# Altium project STM32L496 Breakout.PrjPcb
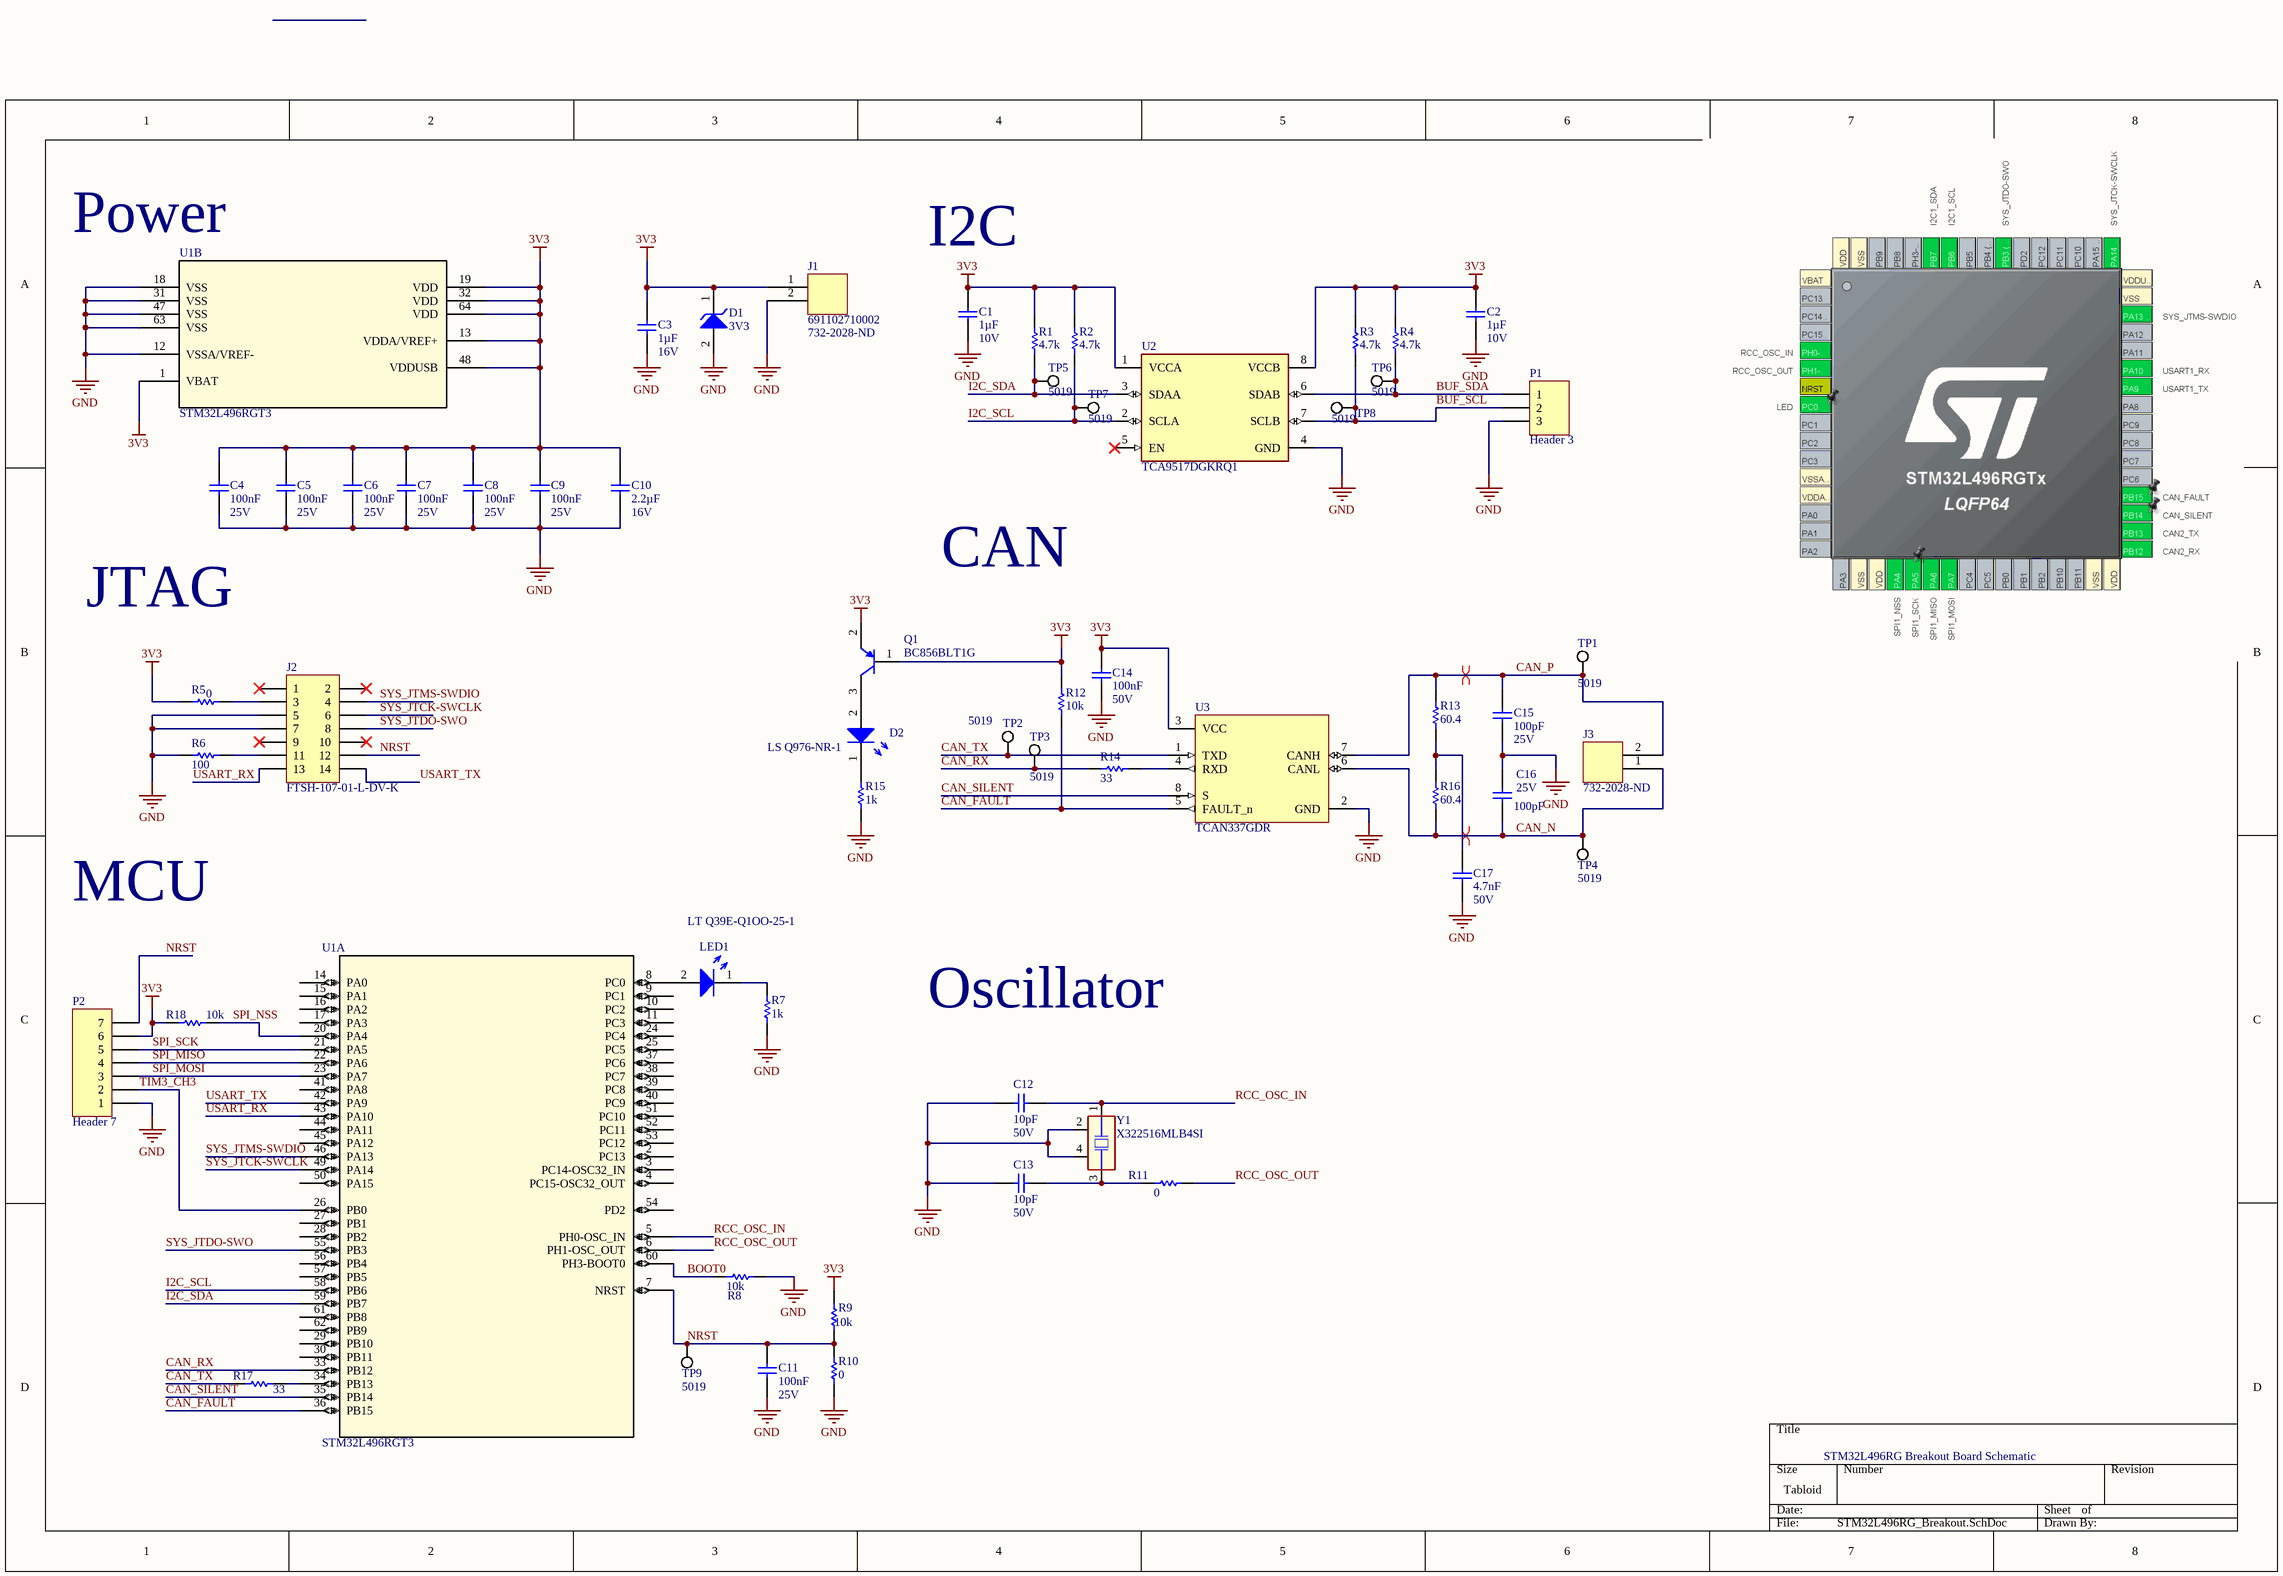
[diagram p0: STM32L496RG_Breakout.SchDoc]
1 sheet, 57 parts. Net scope: global (net labels, ports and power ports of the same name join across sheets).
Board file: STM32L496RG_Breakout.PcbDoc

## Sheet STM32L496RG_Breakout.SchDoc
size Tabloid; SheetNumber: 1; SheetTotal: 1

### Parts
C1  value 1µF  Voltage Rating: 10V  [CAP0805R]  (hidden comment: LMK212B7105KGHTR)
C2  value 1µF  Voltage Rating: 10V  [CAP0805R]  (hidden comment: LMK212B7105KGHTR)
C3  value 1µF  Voltage Rating: 16V  [CAP0805R]  (hidden comment: GCM21BR71C105KA58L)
C4  value 100nF  Voltage Rating: 25V  [CAP0603R]  (hidden comment: CGA3E2X7R1E104K080AA)
C5  value 100nF  Voltage Rating: 25V  [CAP0603R]  (hidden comment: CGA3E2X7R1E104K080AA)
C6  value 100nF  Voltage Rating: 25V  [CAP0603R]  (hidden comment: CGA3E2X7R1E104K080AA)
C7  value 100nF  Voltage Rating: 25V  [CAP0603R]  (hidden comment: CGA3E2X7R1E104K080AA)
C8  value 100nF  Voltage Rating: 25V  [CAP0603R]  (hidden comment: CGA3E2X7R1E104K080AA)
C9  value 100nF  Voltage Rating: 25V  [CAP0603R]  (hidden comment: CGA3E2X7R1E104K080AA)
C10  value 2.2µF  Voltage Rating: 16V  [CAP0805R]  (hidden comment: GCM21BR71C225KA64L)
C11  value 100nF  Voltage Rating: 25V  [CAP0603R]  (hidden comment: CGA3E2X7R1E104K080AA)
C12  value 10pF  Voltage Rating: 50V  [CAP0402R]  (hidden comment: GCQ1555C1H100JB01D)
C13  value 10pF  Voltage Rating: 50V  [CAP0402R]  (hidden comment: GCQ1555C1H100JB01D)
C14  value 100nF  Voltage Rating: 50V  [CAP0603R]  (hidden comment: CGA3E2X7R1H104K080AE)
C15  value 100pF  Voltage Rating: 25V  [CAP0603R]  (hidden comment: C0603C101K3GACTU)
C16  value 100pF  Voltage Rating: 25V  [CAP0603R]  (hidden comment: C0603C101K3GACTU)
C17  value 4.7nF  Voltage Rating: 50V  [CAP0603R]  (hidden comment: CGA3E2X7R1H472K080AA)
D1  3V3  [ONSC-SOD-323-2-477-02_V]
D2  LS Q976-NR-1  [LED0603]
J1  691102710002  Supplier Part Number 1: 732-2028-ND  [CON2_SCREW_5.00MM_691102710002]
J2  FTSH-107-01-L-DV-K  [FP-FTSH-107-01-L-DV-K-MFG]
J3  Supplier Part Number 1: 732-2028-ND  [CON2_SCREW_5.00MM_691102710002]  (hidden comment: 691102710002)
LED1  LT Q39E-Q1OO-25-1  [LED0603]
P1  Header 3  [HDR1X3]
P2  Header 7  [HDR1X7]
Q1  BC856BLT1G  [ONSC-SOT-23-3-318-08_V]
R1  value 4.7k  [RES0603R]  (hidden comment: CRCW06034K70FKEA)
R2  value 4.7k  [RES0603R]  (hidden comment: CRCW06034K70FKEA)
R3  value 4.7k  [RES0603R]  (hidden comment: CRCW06034K70FKEA)
R4  value 4.7k  [RES0603R]  (hidden comment: CRCW06034K70FKEA)
R5  value 0  [RES0805R]  (hidden comment: ERJ-6GEY0R00V)
R6  value 100  [RES0603R]  (hidden comment: ERJ-3GEYJ101V)
R7  value 1k  [RES0805R]  (hidden comment: CRCW08051K00FKTC)
R8  value 10k  [RES0603R]  (hidden comment: ERJ-3GEYJ103V)
R9  value 10k  [RES0603R]  (hidden comment: ERJ-3GEYJ103V)
R10  value 0  [RES0805R]  (hidden comment: ERJ-6GEY0R00V)
R11  value 0  [RES0805R]  (hidden comment: ERJ-6GEY0R00V)
R12  value 10k  [RES0603R]  (hidden comment: CRCW060310K0FKEA)
R13  value 60.4  [RES0603R]  (hidden comment: CRCW060360R4FKEA)
R14  value 33  [RES0603R]  (hidden comment: CRCW060333R0FKEA)
R15  value 1k  [RES0603R]  (hidden comment: CRCW06031K00FKEA)
R16  value 60.4  [RES0603R]  (hidden comment: CRCW060360R4FKEA)
R17  value 33  [RES0603R]  (hidden comment: CRCW060333R0FKEA)
R18  value 10k  [RES0603R]  (hidden comment: RCG060310K0FKEA)
TP1  5019  [KSTN-5019_V]
TP2  5019  [KSTN-5019_V]
TP3  5019  [KSTN-5019_V]
TP4  5019  [KSTN-5019_V]
TP5  5019  [KSTN-5019_V]
TP6  5019  [KSTN-5019_V]
TP7  5019  [KSTN-5019_V]
TP8  5019  [KSTN-5019_V]
TP9  5019  [KSTN-5019_V]
U1  STM32L496RGT3  [LQFP64-10x10mm]  (parts A,B of 2)
U2  TCA9517DGKRQ1  [FP-DGK0008A-MFG]
U3  TCAN337GDR  [TI-D0008A]
Y1  X322516MLB4SI  [X322516MLB4SI-Footprint-1]

### Nets
3V3: C1.2 C2.2 C3.2 C4.2 C5.2 C6.2 C7.2 C8.2 C9.2 C10.2 C14.2 D1.1(K) J1.1 P2.6 Q1.1(B) Q1.2(E) R1.2 R2.2 R3.2 R4.2 R5.1 R9.2 R12.2 R18.1 U1.1(VBAT) U1.13(VDDA/VREF+) U1.19(VDD) U1.32(VDD) U1.48(VDDUSB) U1.64(VDD) U2.1(VCCA) U2.8(VCCB) U3.3(VCC)
GND: C1.1 C2.1 C3.1 C4.1 C5.1 C6.1 C7.1 C8.1 C9.1 C10.1 C11.1 C12.2 C13.2 C14.1 C15.1 C16.2 C17.1 D1.2(A) J1.2 J2.5 J2.7 P1.3 P2.1 R6.1 R7.1 R8.2 R10.1 R15.1 U1.12(VSSA/VREF-) U1.18(VSS) U1.31(VSS) U1.47(VSS) U1.63(VSS) U2.4(GND) U3.2(GND) Y1.2(GND) Y1.4(GND)
BOOT0: R8.1 U1.60(PH3-BOOT0)
BUF_SCL: P1.2 R3.1 TP8.1 U2.7(SCLB)
BUF_SDA: P1.1 R4.1 TP6.1 U2.6(SDAB)
CAN_FAULT: R12.1 U1.36(PB15) U3.5(FAULT_n)
CAN_N: C16.1 J3.1 R16.1 TP4.1 U3.6(CANL)
CAN_P: C15.2 J3.2 R13.2 TP1.1 U3.7(CANH)
CAN_RX: R14.1 TP3.1 U1.33(PB12)
CAN_SILENT: U1.35(PB14) U3.8(S)
CAN_TX: R17.1 TP2.1 U3.1(TXD)
I2C_SCL: R2.1 TP7.1 U1.58(PB6) U2.2(SCLA)
I2C_SDA: R1.1 TP5.1 U1.59(PB7) U2.3(SDAA)
NRST: C11.2 J2.12 P2.7 R9.1 R10.2 TP9.1 U1.7(NRST)
RCC_OSC_IN: C12.1 U1.5(PH0-OSC_IN) Y1.1(OSC1)
RCC_OSC_OUT: R11.2 U1.6(PH1-OSC_OUT)
SPI_MISO: P2.4 U1.22(PA6)
SPI_MOSI: P2.3 U1.23(PA7)
SPI_NSS: R18.2 U1.20(PA4)
SPI_SCK: P2.5 U1.21(PA5)
SYS_JTCK-SWCLK: J2.6 U1.49(PA14)
SYS_JTDO-SWO: J2.8 U1.55(PB3)
SYS_JTMS-SWDIO: J2.4 U1.46(PA13)
TIM3_CH3: P2.2 U1.26(PB0)
USART_RX: J2.13 U1.43(PA10)
USART_TX: J2.14 U1.42(PA9)
NetC13_1: C13.1 R11.1 Y1.3(OSC2)
NetC17_2: C17.2 R13.1 R16.2
NetD2_1: D2.1(Cathode) R15.2
NetD2_2: D2.2(Anode) Q1.3(C)
NetJ2_3: J2.3 R5.2
NetJ2_11: J2.11 R6.2
NetLED1_1: LED1.1(Cathode) R7.2
NetLED1_2: LED1.2(Anode) U1.8(PC0)
NetR14_2: R14.2 U3.4(RXD)
NetR17_2: R17.2 U1.34(PB13)

Not connected (* = marked no-connect by the designer): J2 1* 2* 9* 10*; U1 2(PC13) 3(PC14-OSC32_IN) 4(PC15-OSC32_OUT) 9(PC1) 10(PC2) 11(PC3) 14(PA0) 15(PA1) 16(PA2) 17(PA3) 24(PC4) 25(PC5) 27(PB1) 28(PB2) 29(PB10) 30(PB11) 37(PC6) 38(PC7) 39(PC8) 40(PC9) 41(PA8) 44(PA11) 45(PA12) 50(PA15) 51(PC10) 52(PC11) 53(PC12) 54(PD2) 56(PB4) 57(PB5) 61(PB8) 62(PB9); U2 5(EN)*

### Layout directives
differential pair: CAN_N, CAN_P

### Notes on the sheet
- (near U1) Power
- I2C
- CAN
- JTAG
- MCU
- Oscillator
- STM32L496RG Breakout Board Schematic

### Library data of the parts
C1 C2 = CMP-024-001219-8: CAP CER 1UF 10V X7R 0805; Manufacturer: Taiyo Yuden; Tolerance: 10%; ComponentLink1URL: https://www.yuden.co.jp/productdata/catalog/mlcc_all_hq_e.pdf; Temperature Coefficient: X7R; PN: LMK212B7105KGHTR; Case/Package: 0805 (2012 Metric); Min Operating Temperature: -55°C; Rating: AEC-Q200; Supplier Part Number 1: 587-6338-1-ND; Max Operating Temperature: 125°C; Supplier 1: Digi-Key; ComponentLink1Description: Datasheet
C3 = CMP-024-000717-8: CAP CER 1UF 16V X7R 0805; Manufacturer: Murata Electronics; Tolerance: 10%; Max Operating Temperature: 125°C; Supplier 1: Digi-Key; ComponentLink1URL: https://search.murata.co.jp/Ceramy/image/img/A01X/G101/ENG/GCM21BR71C105KA58-01.pdf; Min Operating Temperature: -55°C; ComponentLink1Description: Datasheet; PN: GCM21BR71C105KA58L; Supplier Part Number 1: 490-14437-1-ND; Temperature Coefficient: X7R; Rating: AEC-Q200; Case/Package: 0805 (2012 Metric)
C4-C9 C11 = CMP-024-000155-8: CAP CER 0.1UF 25V X7R 0603; Manufacturer: TDK Corporation; Tolerance: 10%; Temperature Coefficient: X7R; Supplier 1: Digi-Key; PN: CGA3E2X7R1E104K080AA; ComponentLink1Description: Datasheet; Max Operating Temperature: 125°C; Case/Package: 0603 (1608 Metric); Min Operating Temperature: -55°C; Supplier Part Number 1: 445-5667-1-ND; ComponentLink1URL: https://product.tdk.com/info/en/catalog/datasheets/mlcc_automotive_general_en.pdf?ref_disty=digikey; Rating: AEC-Q200
C10 = CMP-024-000719-8: CAP CER 2.2UF 16V X7R 0805; Manufacturer: Murata Electronics; Tolerance: 10%; Supplier 1: Digi-Key; Max Operating Temperature: 125°C; Supplier Part Number 1: 490-4786-1-ND; ComponentLink1URL: https://psearch.en.murata.com/capacitor/product/GCM21BR71C225KA64%23.pdf; Temperature Coefficient: X7R; Case/Package: 0805 (2012 Metric); Rating: AEC-Q200; PN: GCM21BR71C225KA64L; Min Operating Temperature: -55°C; ComponentLink1Description: Datasheet
C12 C13 = CMP-024-000761-8: CAP CER 10PF 50V C0G/NP0 0402; Manufacturer: Murata Electronics; Temperature Coefficient: C0G, NP0; Tolerance: 5%; PN: GCQ1555C1H100JB01D; Case/Package: 0402 (1005 Metric); Min Operating Temperature: -55°C; ComponentLink1Description: Datasheet; Supplier 1: Digi-Key; ComponentLink1URL: https://search.murata.co.jp/Ceramy/image/img/A01X/G101/ENG/GCQ1555C1H100JB01-01.pdf; Supplier Part Number 1: 490-17423-1-ND; Rating: AEC-Q200; Max Operating Temperature: 125°C
C14 = CMP-024-000175-8: CAP CER 0.1UF 50V X7R 0603; Manufacturer: TDK Corporation; Tolerance: 10%; PN: CGA3E2X7R1H104K080AE; Supplier 1: Digi-Key; Max Operating Temperature: 125°C; ComponentLink1URL: https://product.tdk.com/info/en/catalog/datasheets/mlcc_automotive_soft_en.pdf?ref_disty=digikey; Case/Package: 0603 (1608 Metric); ComponentLink1Description: Datasheet; Temperature Coefficient: X7R; Rating: AEC-Q200; Min Operating Temperature: -55°C; Supplier Part Number 1: 445-15957-1-ND
C15 C16 = CMP-024-000001-8: CAP CER 100PF 25V C0G/NP0 0603; Manufacturer: KEMET; Tolerance: 10%; Temperature Coefficient: C0G, NP0; PN: C0603C101K3GACTU; Supplier Part Number 1: 399-11130-1-ND; Max Operating Temperature: 125°C; Supplier 1: Digi-Key; ComponentLink1URL: https://content.kemet.com/datasheets/KEM_C1003_C0G_SMD.pdf; ComponentLink1Description: Datasheet; Min Operating Temperature: -55°C; Case/Package: 0603 (1608 Metric)
C17 = CMP-024-000204-8: CAP CER 4700PF 50V X7R 0603; Manufacturer: TDK Corporation; Tolerance: 10%; ComponentLink1Description: Datasheet; Max Operating Temperature: 125°C; Supplier Part Number 1: 445-5661-1-ND; ComponentLink1URL: https://product.tdk.com/info/en/catalog/datasheets/mlcc_automotive_general_en.pdf?ref_disty=digikey; PN: CGA3E2X7R1H472K080AA; Min Operating Temperature: -55°C; Case/Package: 0603 (1608 Metric); Temperature Coefficient: X7R; Rating: AEC-Q200; Supplier 1: Digi-Key
D1 = CMP-004-00015-1: Zener Diode, 3.3V V(Z), 6%, 0.3W, Silicon, Unidirectional; Max Operating Temperature: 150°C; RoHS Compliant: Yes
D2 = CMP-029-000016-3: LED RED DIFFUSED 0603 SMD; Manufacturer: OSRAM Opto Semiconductors Inc.; Voltage - Forward Max: 2V; Current - Average: 20mA; Supplier 1: Digi-Key; Package: 0603 (1608 Metric); Type: LED; Supplier Part Number 1: 475-2512-1-ND; ComponentLink1Description: Datasheet; Color: Red; ComponentLink1URL: https://dammedia.osram.info/media/resource/hires/osram-dam-2493499/LS%20Q976.pdf; PN: LS Q976-NR-1
J1 J3 = CMP-027-000000-1: 2 Position Wire to Board Terminal Block Horizontal with Board 0.197" (5.00mm) Through Hole; Manufacturer: Würth Elektronik; Connector Type: Screw Terminal; Number of Positions: 2; Pitch - Mating: 0.197" (5.00mm); ComponentLink1URL: https://www.we-online.de/katalog/datasheet/6911027100xx.pdf; ComponentLink1Description: Datasheet; Supplier 1: Digi-Key; Series: WR-TBL Series 102; PN: 691102710002; Number of Rows: 1; Contact Type: Wire
J2 = CMP-002-00034-3: Conn Unshrouded Header HDR 14 POS 1.27mm Solder ST Top Entry SMD TIGER CLAW™ Tube; Current Rating: 3.4A; Number of Contacts: 14; Gender: Male; Pitch: 1.27mm; Number of Rows: 2; Min Operating Temperature: -55°C; Contact Material: Bronze; Max Operating Temperature: 125°C
LED1 = CMP-029-000017-3: LED GREEN DIFFUSED 0603 SMD; Manufacturer: OSRAM Opto Semiconductors Inc.; Current - Average: 5mA; Voltage - Forward Max: 2.85V; Package: 0603 (1608 Metric); Supplier 1: Digi-Key; PN: LT Q39E-Q1OO-25-1; ComponentLink1URL: https://dammedia.osram.info/media/resource/hires/osram-dam-2493475/LT%20Q39E.pdf; ComponentLink1Description: Datasheet; Type: LED; Supplier Part Number 1: 475-3441-1-ND; Color: Green
P1 = CMP-083-000090-3: Header, 3-Pin; Signal Integrity: Connector; LatestRevisionNote: Re-released for DXP Platform.; Source: Miscellaneous Connectors.SchLib; Design Item ID: Header 3; LatestRevisionDate: 17-Jul-2002; Publisher: Altium Limited; Component Type: Standard; Pin Count: 3
P2 = CMP-083-000112-2: Header, 7-Pin; Signal Integrity: Connector; Component Type: Standard; Publisher: Altium Limited; Pin Count: 7; LatestRevisionDate: 17-Jul-2002; Source: Miscellaneous Connectors.SchLib; Design Item ID: Header 7; LatestRevisionNote: Re-released for DXP Platform.
Q1 = CMP-013-00001-2: Small Signal Bipolar Transistor, 0.1A I(C), 65V V(BR)CEO, 1-Element, PNP, Silicon, TO-236AB
R1-R4 = CMP-054-001314-6: RES SMD 4.7K OHM 1% 1/10W 0603; Manufacturer: Vishay Dale; Power: 100mW; Tolerance: 1%; Rating: AEC-Q200; Supplier Part Number 1: 541-4.70KHCT-ND; Composition: Thick Film; Supplier 1: Digi-Key; Min Operating Temperature: -55°C; Case/Package: 0603 (1608 Metric); ComponentLink1Description: Datasheet; ComponentLink1URL: https://www.vishay.com/docs/20035/dcrcwe3.pdf; Max Operating Temperature: 155°C; PN: CRCW06034K70FKEA
R5 R10 R11 = CMP-054-002879-6: RES SMD 0 OHM JUMPER 1/8W 0805; Manufacturer: Panasonic; Power: 125mW; Tolerance: 0%; PN: ERJ-6GEY0R00V; Composition: Thick Film; Case/Package: 0805 (2012 Metric); Min Operating Temperature: -55°C; Rating: AEC-Q200; Supplier 1: Digi-Key; ComponentLink1URL: http://industrial.panasonic.com/www-cgi/jvcr13pz.cgi?E+PZ+3+AOA0001+ERJ6GEY0R00V+7+WW; Supplier Part Number 1: P0.0ACT-ND; Max Operating Temperature: 155°C; ComponentLink1Description: Datasheet
R6 = CMP-054-002817-6: RES SMD 100 OHM 5% 1/10W 0603; Manufacturer: Panasonic; Power: 100mW; Min Operating Temperature: -55°C; Max Operating Temperature: 155°C; Rating: AEC-Q200; PN: ERJ-3GEYJ101V; ComponentLink1Description: Datasheet; Tolerance: 5%; Supplier Part Number 1: P100GCT-ND; Supplier 1: Digi-Key; Case/Package: 0603 (1608 Metric); ComponentLink1URL: http://industrial.panasonic.com/www-cgi/jvcr13pz.cgi?E+PZ+3+AOA0001+ERJ3GEYJ101V+7+WW; Composition: Thick Film
R7 = CMP-054-001714-6: RES SMD 1K OHM 1% 1/8W 0805; Manufacturer: Vishay Dale; Power: 125mW; PN: CRCW08051K00FKTC; Rating: AEC-Q200; Max Operating Temperature: 155°C; Supplier Part Number 1: 541-4320-1-ND; Tolerance: 1%; Min Operating Temperature: -55°C; ComponentLink1URL: https://www.vishay.com/docs/20008/dcrcw.pdf; Supplier 1: Digi-Key; ComponentLink1Description: Datasheet; Case/Package: 0805 (2012 Metric); Composition: Thick Film
R8 R9 = CMP-054-002819-6: RES SMD 10K OHM 5% 1/10W 0603; Manufacturer: Panasonic; Power: 100mW; ComponentLink1URL: http://industrial.panasonic.com/www-cgi/jvcr13pz.cgi?E+PZ+3+AOA0001+ERJ3GEYJ103V+7+WW; Rating: AEC-Q200; Max Operating Temperature: 155°C; Min Operating Temperature: -55°C; Tolerance: 5%; Supplier Part Number 1: P10KGCT-ND; PN: ERJ-3GEYJ103V; Case/Package: 0603 (1608 Metric); ComponentLink1Description: Datasheet; Composition: Thick Film; Supplier 1: Digi-Key
R12 = CMP-054-000780-6: RES SMD 10K OHM 1% 1/10W 0603; Manufacturer: Vishay Dale; Power: 100mW; Composition: Thick Film; Supplier 1: Digi-Key; Max Operating Temperature: 155°C; Supplier Part Number 1: 541-10.0KHCT-ND; ComponentLink1Description: Datasheet; Case/Package: 0603 (1608 Metric); Tolerance: 1%; Min Operating Temperature: -55°C; ComponentLink1URL: https://www.vishay.com/docs/20035/dcrcwe3.pdf; Rating: AEC-Q200; PN: CRCW060310K0FKEA
R13 R16 = CMP-054-001409-6: RES SMD 60.4 OHM 1% 1/10W 0603; Manufacturer: Vishay Dale; Power: 100mW; Tolerance: 1%; Supplier Part Number 1: 541-60.4HCT-ND; Case/Package: 0603 (1608 Metric); Supplier 1: Digi-Key; Max Operating Temperature: 155°C; Min Operating Temperature: -55°C; PN: CRCW060360R4FKEA; Rating: AEC-Q200; Composition: Thick Film; ComponentLink1Description: Datasheet; ComponentLink1URL: https://www.vishay.com/docs/20035/dcrcwe3.pdf
R14 R17 = CMP-054-001172-6: RES SMD 33 OHM 1% 1/10W 0603; Manufacturer: Vishay Dale; Power: 100mW; Supplier 1: Digi-Key; Supplier Part Number 1: 541-33.0HCT-ND; Max Operating Temperature: 155°C; ComponentLink1URL: https://www.vishay.com/docs/20035/dcrcwe3.pdf; PN: CRCW060333R0FKEA; Composition: Thick Film; Min Operating Temperature: -55°C; Tolerance: 1%; Case/Package: 0603 (1608 Metric); Rating: AEC-Q200; ComponentLink1Description: Datasheet
R15 = CMP-054-000905-6: RES SMD 1K OHM 1% 1/10W 0603; Manufacturer: Vishay Dale; Power: 100mW; Supplier 1: Digi-Key; PN: CRCW06031K00FKEA; Composition: Thick Film; ComponentLink1URL: https://www.vishay.com/docs/20035/dcrcwe3.pdf; Max Operating Temperature: 155°C; Tolerance: 1%; Case/Package: 0603 (1608 Metric); Rating: AEC-Q200; Min Operating Temperature: -55°C; Supplier Part Number 1: 541-1.00KHCT-ND; ComponentLink1Description: Datasheet
R18 = CMP-054-002885-6: RES SMD 10K OHM 1% 1/10W 0603; Manufacturer: Vishay Dale; Power: 100mW; Tolerance: 1%; ComponentLink1URL: https://www.vishay.com/docs/20047/rcge3.pdf; PN: RCG060310K0FKEA; ComponentLink1Description: Datasheet; Composition: Thick Film; Max Operating Temperature: 155°C; Supplier 1: Digi-Key; Case/Package: 0603 (1608 Metric); Rating: AEC-Q200; Supplier Part Number 1: 541-1784-2-ND; Min Operating Temperature: -55°C
TP1-TP9 = CMP-000000-1: Interconnection Device
U1 = STM32L496RGT3: Ultra-low-power with FPU Arm Cortex-M4 MCU 80 MHz with 1 Mbyte of Flash memory, USB OTG, LCD, DFSDM; Manufacturer_Name: STMicroelectronics; Copyright: Copyright (C) 2025 Ultra Librarian. All rights reserved.; Manufacturer_Part_Number: STM32L496RGT3; RefDes: RefDes; Type: Type
U2 = CMP-015-00008-5: Voltage Level Translator Bidirectional 1 Circuit 2 Channel 8-VSSOP; Frequency: 400kHz; Max Operating Temperature: 125°C; Case/Package: VSSOP; Min Operating Temperature: -40°C; Channel Type: Bidirectional
U3 = CMP-046-000003-9: Interface Circuit, PDSO8; Manufacturer: Texas Instruments; Number of Drivers/Receivers: 1/1; Protocol: CANFD; Voltage - Supply: 3V ~ 3.6V; Data Rate: 5Mbps; Duplex: -; Min Operating Temperature: -40°C; Package: 8-SOIC; Supplier Part Number 1: 296-44213-2-ND; ComponentLink1URL: https://www.ti.com/lit/ds/symlink/tcan337.pdf?HQS=TI-null-null-digikeymode-df-pf-null-wwe&ts=1598102384823; Max Operating Temperature: 125°C; Type: Transceiver; ComponentLink1Description: Datasheet; Supplier 1: Digi-Key; PN: TCAN337GDR
Y1 = CMP-003-00003-2: 16MHz Surface Mount Crystal 9pF ±10ppm ±20ppm SMD3225-4P Crystals ROHS; Frequency: 16MHz